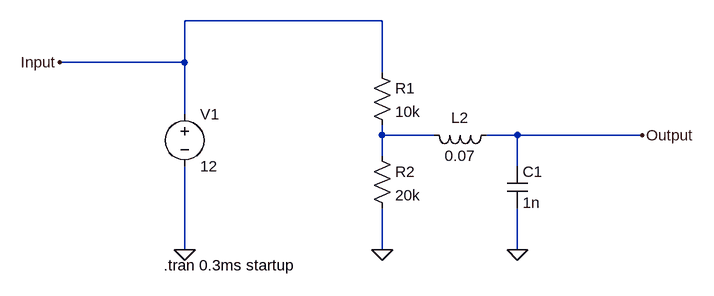
[diagram p0: schematic Simple voltage divider circuit with effect of capacitor for ramp voltage.asc]
Simple voltage divider circuit with effect of capacitor for ramp voltage.asc, the LTspice schematic file:
Version 4
SHEET 1 880 680
WIRE 208 32 -96 32
WIRE -96 96 -96 32
WIRE -96 96 -288 96
WIRE 208 112 208 32
WIRE -96 176 -96 96
WIRE 208 208 208 192
WIRE 288 208 208 208
WIRE 416 208 368 208
WIRE 608 208 416 208
WIRE 208 240 208 208
WIRE 416 256 416 208
WIRE -96 384 -96 256
WIRE 208 384 208 320
WIRE 416 384 416 320
FLAG -96 384 0
FLAG 208 384 0
FLAG -288 96 Input
FLAG 608 208 Output
FLAG 416 384 0
SYMBOL res 192 96 R0
SYMATTR InstName R1
SYMATTR Value 10k
SYMBOL res 192 224 R0
SYMATTR InstName R2
SYMATTR Value 20k
SYMBOL voltage -96 160 R0
WINDOW 123 0 0 Left 0
WINDOW 39 0 0 Left 0
SYMATTR InstName V1
SYMATTR Value 12
SYMBOL cap 400 256 R0
SYMATTR InstName C1
SYMATTR Value 1n
SYMBOL ind 384 192 R90
WINDOW 0 5 56 VBottom 2
WINDOW 3 32 56 VTop 2
SYMATTR InstName L2
SYMATTR Value 0.07
TEXT -128 408 Left 2 !.tran 0.3ms startup

The netlist it stands for:
* Simple voltage divider circuit with effect of capacitor for ramp voltage.asc
R1 Input N001 10k
R2 N001 0 20k
V1 Input 0 12
C1 Output 0 1n
L2 Output N001 0.07
.tran 0.3ms startup
.backanno
.end